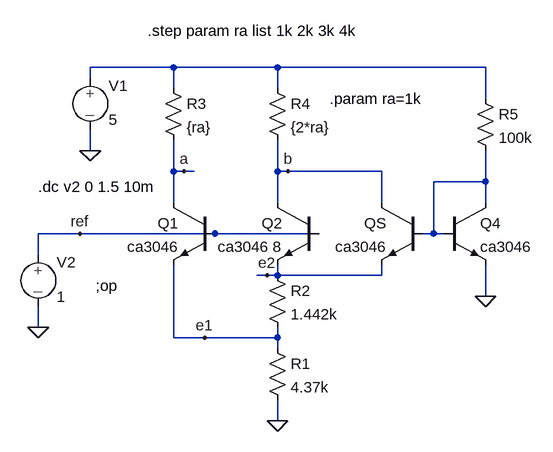
[diagram p0: schematic bg_kenn.asc]
bg_kenn.asc, the LTspice schematic file:
Version 4
SHEET 1 880 680
WIRE 128 -48 0 -48
WIRE 288 -48 128 -48
WIRE 608 -48 288 -48
WIRE 0 -32 0 -48
WIRE 128 -16 128 -48
WIRE 288 -16 288 -48
WIRE 608 0 608 -48
WIRE 0 80 0 48
WIRE 128 112 128 64
WIRE 144 112 128 112
WIRE 160 112 144 112
WIRE 288 112 288 64
WIRE 304 112 288 112
WIRE 448 112 304 112
WIRE 608 128 608 80
WIRE 608 128 528 128
WIRE 128 160 128 112
WIRE 288 160 288 112
WIRE 448 160 448 112
WIRE 608 160 608 128
WIRE -16 208 -80 208
WIRE 192 208 -16 208
WIRE 352 208 192 208
WIRE 528 208 528 128
WIRE 528 208 512 208
WIRE 544 208 528 208
WIRE -80 240 -80 208
WIRE 272 272 256 272
WIRE 288 272 288 256
WIRE 288 272 272 272
WIRE 448 272 448 256
WIRE 448 272 288 272
WIRE 608 304 608 256
WIRE -80 352 -80 320
WIRE 128 368 128 256
WIRE 176 368 128 368
WIRE 288 368 288 352
WIRE 288 368 176 368
WIRE 288 384 288 368
WIRE 288 496 288 464
FLAG 288 496 0
FLAG 0 80 0
FLAG -16 208 ref
FLAG 176 368 e1
FLAG 272 272 e2
FLAG -80 352 0
FLAG 304 112 b
FLAG 144 112 a
FLAG 608 304 0
SYMBOL EIT_Semiconductors\\npn 192 160 M0
SYMATTR InstName Q1
SYMATTR Value ca3046
SYMBOL EIT_Semiconductors\\npn 352 160 M0
SYMATTR InstName Q2
SYMATTR Value ca3046 8
SYMBOL res 272 256 R0
SYMATTR InstName R2
SYMATTR Value 1.442k
SYMBOL res 272 368 R0
SYMATTR InstName R1
SYMATTR Value 4.37k
SYMBOL res 112 -32 R0
SYMATTR InstName R3
SYMATTR Value {ra}
SYMBOL res 272 -32 R0
SYMATTR InstName R4
SYMATTR Value {2*ra}
SYMBOL source-V 0 -48 R0
SYMATTR InstName V1
SYMATTR Value 5
SYMBOL source-V -80 224 R0
SYMATTR InstName V2
SYMATTR Value 1
SYMBOL EIT_Semiconductors\\npn 512 160 M0
SYMATTR InstName QS
SYMATTR Value ca3046
SYMBOL EIT_Semiconductors\\npn 544 160 R0
SYMATTR InstName Q4
SYMATTR Value ca3046
SYMBOL res 592 -16 R0
SYMATTR InstName R5
SYMATTR Value 100k
TEXT 8 288 Left 2 !;op
TEXT -80 136 Left 2 !.dc v2 0 1.5 10m
TEXT 368 0 Left 2 !.param ra=1k
TEXT 88 -104 Left 2 !.step param ra list 1k 2k 3k 4k

The netlist it stands for:
* bg_kenn.asc
Q1 a ref e1 0 ca3046
Q2 b ref e2 0 ca3046 8
R2 e2 e1 1.442k
R1 e1 0 4.37k
R3 N001 a {ra}
R4 N001 b {2*ra}
V1 N001 0 5
V2 ref 0 1
QS b N002 e2 0 ca3046
Q4 N002 N002 0 0 ca3046
R5 N001 N002 100k
.model NPN NPN
.model PNP PNP
.lib standard.bjt
;op
.dc v2 0 1.5 10m
.param ra=1k
.step param ra list 1k 2k 3k 4k
.backanno
.end